# EAGLE design Dead Time (EAGLE 5.11)
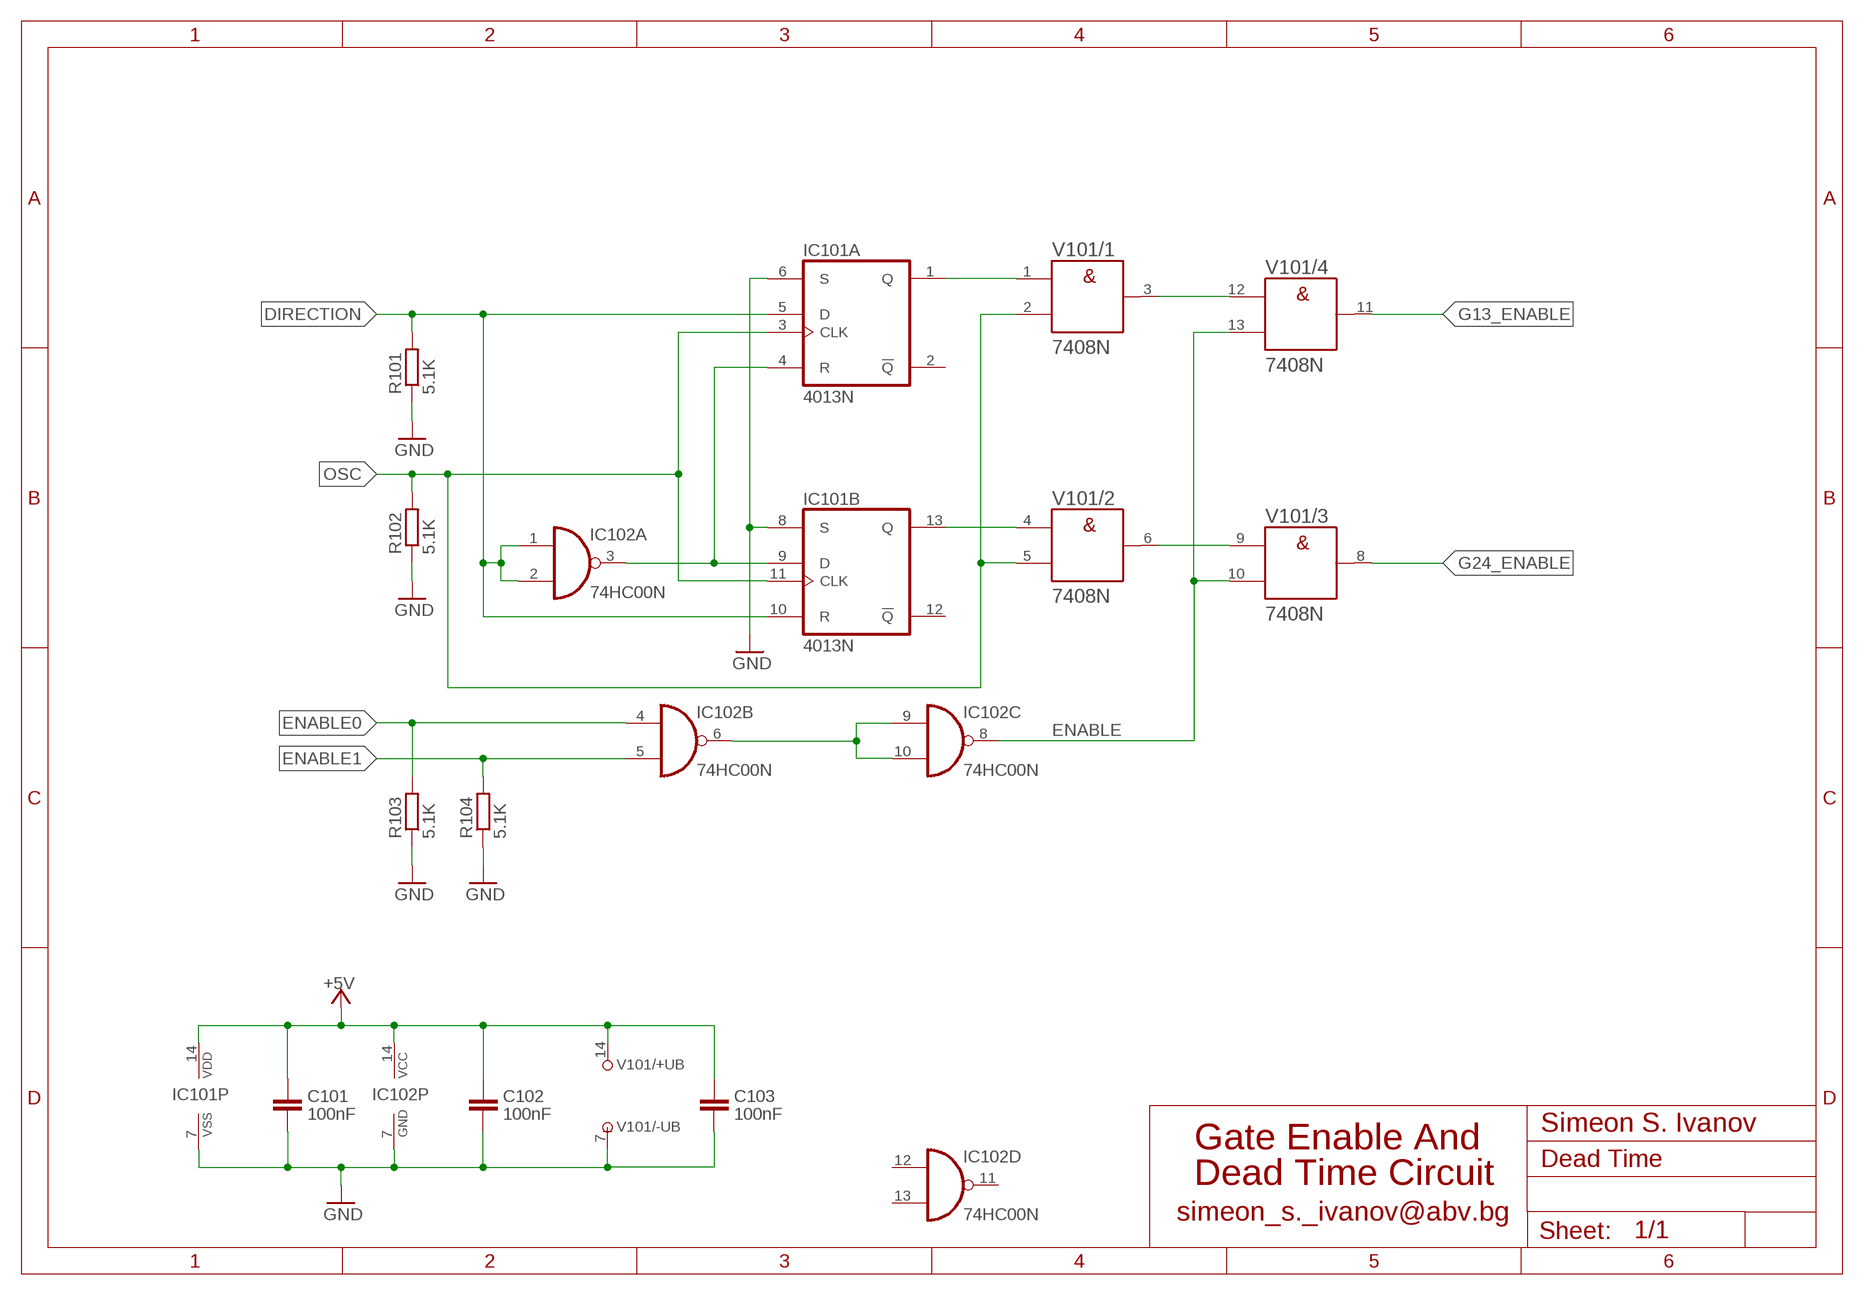
[diagram p0: schematic, sheet 1]

## Parts
C101  100nF  C-EUC0805  [C0805]
C102  100nF  C-EUC0805  [C0805]
C103  100nF  C-EUC0805  [C0805]
IC101  4013N  [DIL14]
IC102  74HC00N  [DIL14]
R101  5.1K  R-EU_0204/5  [0204/5]
R102  5.1K  R-EU_0204/5  [0204/5]
R103  5.1K  R-EU_0204/5  [0204/5]
R104  5.1K  R-EU_0204/5  [0204/5]
V101  7408N  [DIL14]

## Nets
!ENABLE: IC102.6(B:O) IC102.9(C:I0) IC102.10(C:I1)
+5V: C101.1 C102.1 C103.1 IC101.14(P:VDD) IC102.14(P:VCC) V101.14(/+UB:+UB)
DIRECTION: IC101.5(A:D) IC101.10(B:R) IC102.1(A:I0) IC102.2(A:I1) R101.2
ENABLE: IC102.8(C:O) V101.10(/3:B) V101.13(/4:B)
ENABLE0: IC102.4(B:I0) R103.2
ENABLE1: IC102.5(B:I1) R104.2
G13_ENABLE: V101.11(/4:Y)
G24_ENABLE: V101.8(/3:Y)
GND: C101.2 C102.2 C103.2 IC101.6(A:S) IC101.7(P:VSS) IC101.8(B:S) IC102.7(P:GND) R101.1 R102.1 R103.1 R104.1 V101.7(/-UB:-UB)
N$1: IC101.1(A:Q) V101.1(/1:A)
N$2: IC101.13(B:Q) V101.4(/2:A)
N$3: V101.3(/1:Y) V101.12(/4:A)
N$4: V101.6(/2:Y) V101.9(/3:A)
N$16: IC101.4(A:R) IC101.9(B:D) IC102.3(A:O)
OSC: IC101.3(A:CLK) IC101.11(B:CLK) R102.2 V101.2(/1:B) V101.5(/2:B)
Unconnected: IC101.2(A:!Q) IC101.12(B:!Q) IC102.11(D:O) IC102.12(D:I0) IC102.13(D:I1)

## Notes on the sheet
- Simeon S. Ivanov
- Gate Enable And
- Dead Time Circuit
- simeon_s._ivanov@abv.bg

## Library data of the parts
C101-C103 = rcl:C-EU: CAPACITOR, European symbol
IC101 = 40xx:4013: Dual D FLIP FLOP, set/reset
IC102 = 74xx-eu:74*00: Quad 2-input NAND gate
R101-R104 = rcl:R-EU_: RESISTOR, European symbol
V101 = 74ttl-din:74*08: Quad 2-input AND gate

## Board
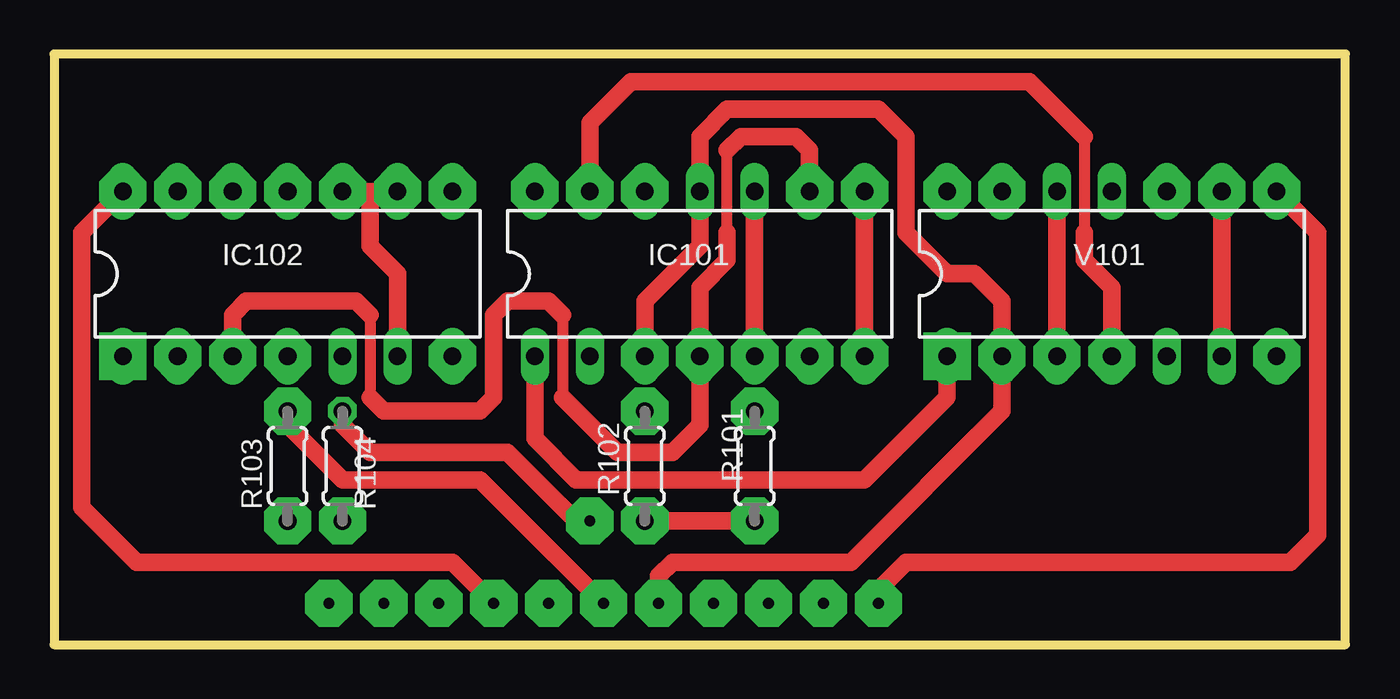
[diagram p1: board, top side]
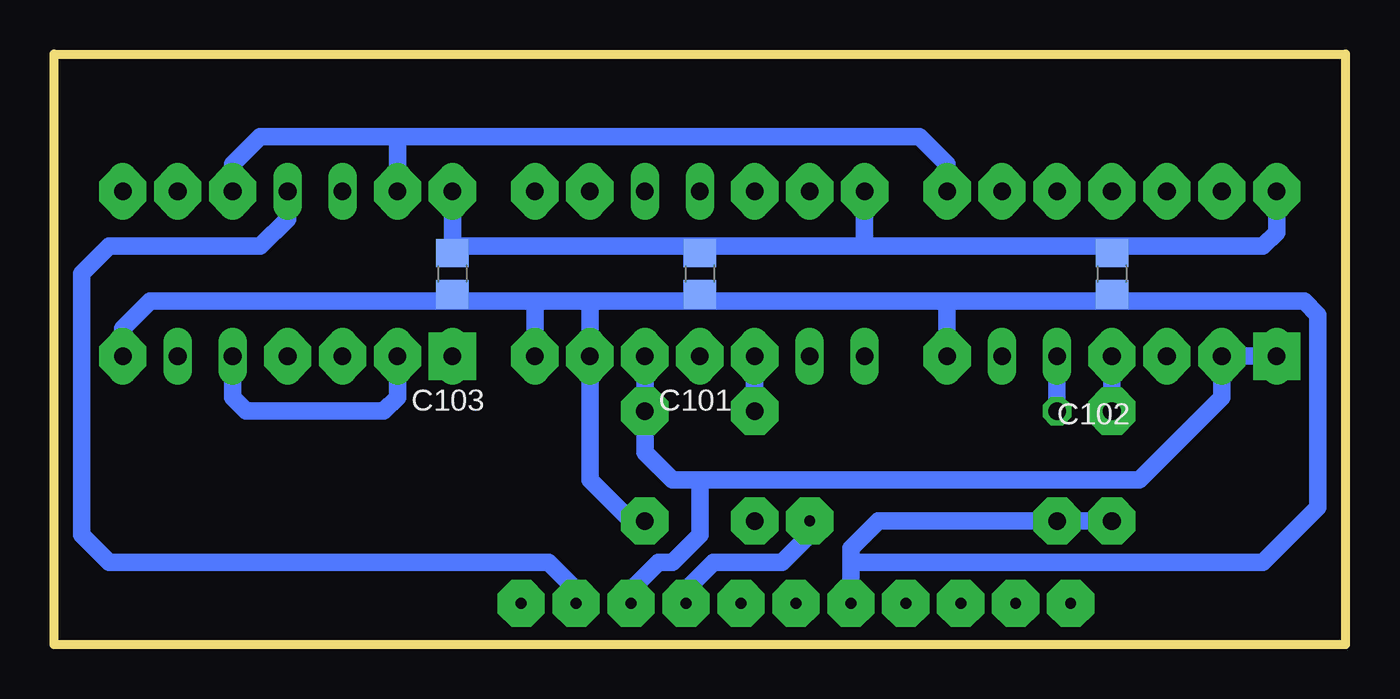
[diagram p2: board, bottom side, seen from below]

Size 59.69 x 27.3 mm. Coordinates in mm from the lower left corner, seen from the top.
Outline: 0,0 59.69,0 59.69,27.3 0,27.3 0,0
Copper layers (1*16): Top 0.035mm / dielectric 1.5mm / Bottom 0.035mm
Design rules "default": minimum track width 10mil, minimum drill 24mil, track to track 8mil, track to pad 8mil, pad to pad 8mil, via to via 8mil, smd to smd 8mil, copper to edge 40mil, drill to drill 8mil, minimum pad ring 10mil, minimum via ring 8mil, stop-mask expansion 4mil, vias tented up to drill 0mil, thermal gap 10mil

### Footprints (pad centres in the part's own frame; a part is rotated, then mirrored left to right if it is on the bottom)
C0805 = smd 1.3 x 1.5: 1 -0.95,0; 2 0.95,0
DIL14 = drill 0.813 long: 1 -7.62,-3.81; 2 -5.08,-3.81; 3 -2.54,-3.81; 4 0,-3.81; 5 2.54,-3.81; 6 5.08,-3.81; 7 7.62,-3.81; 8 7.62,3.81; 9 5.08,3.81; 10 2.54,3.81; 11 0,3.81; 12 -2.54,3.81; 13 -5.08,3.81; 14 -7.62,3.81
0204/5 = drill 0.813 octagon: 1 -2.54,0; 2 2.54,0

### Placement (x,y rotation side)
C101  29.84,17.14 270 bottom
C102  10.79,17.14 270 bottom
C103  41.27,17.14 270 bottom
IC101  29.84,17.14 0 top
IC102  10.79,17.14 0 top
R101  32.38,8.26 90 top
R102  27.3,8.26 90 top
R103  10.79,8.26 90 top
R104  13.34,8.26 90 top
V101  48.9,17.14 0 top

### Tracks (layer width: path | path; a pad name or v marks a point on that pad's centre or on a via)
!ENABLE  (via drill 0.5 pad 2.18)
  Top 0.813: IC102.6 15.88,17.14 14.61,18.41 14.61,20.95 | 14.61,20.95 IC102.10 | 14.61,20.95 IC102.9
  other vias: 13.34,20.95 15.88,20.95
+5V  (via drill 0.5 pad 2.18)
  Top 0.813: v20.32,1.91 18.41,3.81 3.81,3.81 1.27,6.35 1.27,19.05 IC102.14
  Bottom 0.813: IC102.14 3.17,19.05 3.81,18.41 10.79,18.41 | 10.79,18.41 22.23,18.41 | 22.23,18.41 29.84,18.41 | 29.84,18.41 41.27,18.41 | 22.23,18.41 v22.23,20.95 | 41.27,18.41 v41.27,20.95 | 29.84,18.41 C101.1 | 10.79,18.41 C102.1 | 41.27,18.41 C103.1
  other vias: 3.17,20.95
DIRECTION  (via drill 0.5 pad 1.27, 0.5 pad 2.18)
  Top 0.813: v32.38,13.34 IC101.10
  Bottom 0.813: v3.17,13.34 v5.71,13.34 5.71,11.43 9.53,7.62 29.84,7.62 | v32.38,13.34 v32.38,10.79 32.38,8.89 31.11,7.62 29.84,7.62 | v33.02,1.91 33.02,2.54 31.75,3.81 31.11,3.81 29.84,5.08 29.84,7.62
  other vias: 32.38,20.95
ENABLE  (via drill 0.5 pad 2.18)
  Bottom 0.813: 43.81,23.5 50.16,23.5 51.44,22.23 V101.10 | IC102.8 18.41,22.23 19.68,23.5 43.81,23.5 | 43.81,23.5 v43.81,20.95
  other vias: 51.44,20.95
ENABLE0  (via drill 0.5 pad 2.18)
  Top 0.813: v25.4,1.91 22.86,4.45 19.68,7.62 13.34,7.62 10.79,10.16 v10.79,10.79
  Bottom 0.813: v10.79,10.79 IC102.4
ENABLE1  (via drill 0.5 pad 1.27, 0.5 pad 2.18)
  Top 0.813: v13.34,10.79 13.34,10.16 14.61,8.89 20.95,8.89 24.13,5.71 v24.77,5.71
  Bottom 0.813: v13.34,10.79 IC102.5 | v30.48,1.91 30.48,2.54 29.21,3.81 26.67,3.81 26.04,3.81 24.77,5.08 v24.77,5.71
G13_ENABLE  (via drill 0.5 pad 1.27, 0.5 pad 2.18)
  Bottom 0.813: v35.56,1.91 35.56,2.54 36.83,3.81 57.15,3.81 58.42,5.08 58.42,17.14 57.15,18.41 50.16,18.41 48.9,19.68 V101.11
  other vias: 48.9,20.95
G24_ENABLE  (via drill 0.5 pad 2.18)
  Top 0.813: v38.1,1.91 38.1,2.54 39.37,3.81 57.15,3.81 58.42,5.08 58.42,19.05 V101.8
  other vias: 56.52,20.95
GND  (via drill 0.5 pad 2.18)
  Top 0.813: v37.47,13.34 v37.47,20.95 | v27.3,5.71 v32.38,5.71
  Bottom 0.813: 18.41,15.88 v18.41,13.34 | 10.79,15.88 1.91,15.88 1.27,15.24 1.27,6.35 3.81,3.81 22.86,3.81 | 10.79,15.88 18.41,15.88 | 18.41,15.88 29.84,15.88 | 29.84,15.88 34.92,15.88 | 34.92,15.88 37.47,15.88 | 37.47,15.88 41.27,15.88 | 41.27,15.88 55.24,15.88 56.52,14.61 v56.52,13.34 | 37.47,15.88 v37.47,13.34 | 34.92,15.88 v34.92,13.34 34.92,7.62 33.02,5.71 v32.38,5.71 | 29.84,15.88 C101.2 | 10.79,15.88 C102.2 | 22.86,3.81 v22.86,1.91 | 41.27,15.88 C103.2 | v10.79,5.71 v13.34,5.71 | v10.79,5.71 10.79,5.08 | v10.79,5.71 21.59,5.71 22.86,4.45 22.86,3.81
N$1  (via drill 0.5 pad 1.27, 0.5 pad 2.18)
  Top 0.813: v22.23,13.34 22.23,9.53 24.13,7.62 37.47,7.62 41.27,11.43 v41.27,13.34
N$2  (via drill 0.5 pad 2.18)
  Top 0.508: 47.62,23.5 47.62,19.05
  Top 0.813: IC101.13 24.77,24.13 26.67,26.04 45.09,26.04 47.62,23.5 | v48.9,13.34 48.9,16.51 47.62,17.78 47.62,19.05
  other vias: 24.77,20.95
N$3  (via drill 0.5 pad 1.27, 0.5 pad 2.18)
  Top 0.813: v46.35,13.34 v46.35,20.95
N$4  (via drill 0.5 pad 1.27, 0.5 pad 2.18)
  Top 0.813: v53.98,13.34 V101.9
  other vias: 53.98,20.95
N$5  (via drill 0.5 pad 2.18)
  other vias: 5.71,20.95
N$6  (via drill 0.5 pad 2.18)
  other vias: 8.26,20.95
N$7  (via drill 0.5 pad 2.18)
  other vias: 10.79,20.95
N$8  (via drill 0.5 pad 2.18)
  other vias: 17.78,1.91
N$9  (via drill 0.5 pad 2.18)
  other vias: 15.24,1.91
N$10  (via drill 0.5 pad 2.18)
  other vias: 18.41,20.95
N$11  (via drill 0.5 pad 1.27)
  other vias: 13.34,13.34
N$12  (via drill 0.5 pad 2.18)
  other vias: 10.79,13.34
N$13  (via drill 0.5 pad 1.27)
  other vias: 15.88,13.34
N$14  (via drill 0.5 pad 2.18)
  other vias: 27.3,20.95
N$15  (via drill 0.5 pad 1.27)
  other vias: 24.77,13.34
N$16  (via drill 0.5 pad 2.18)
  Top 0.508: 14.61,15.24 14.61,11.43 | 23.5,15.24 23.5,11.43 | 31.11,19.05 31.11,22.86
  Top 0.813: IC101.9 34.92,22.86 34.29,23.5 31.75,23.5 31.11,22.86 | v8.26,13.34 8.26,15.24 8.89,15.88 13.97,15.88 14.61,15.24 | 14.61,11.43 15.24,10.79 19.68,10.79 20.32,11.43 20.32,15.24 20.95,15.88 22.86,15.88 23.5,15.24 | 23.5,11.43 26.04,8.89 28.57,8.89 29.84,10.16 v29.84,13.34 29.84,16.51 31.11,17.78 31.11,19.05
  other vias: 34.92,20.95
N$17  (via drill 0.5 pad 2.18)
  other vias: 12.7,1.91
OSC  (via drill 0.5 pad 1.27, 0.5 pad 2.18)
  Top 0.813: v27.3,13.34 27.3,15.88 29.84,18.41 IC101.11 29.84,23.5 31.11,24.77 38.1,24.77 39.37,23.5 39.37,19.05 41.27,17.14 42.55,17.14 43.81,15.88 v43.81,13.34 43.81,10.79 36.83,3.81 28.57,3.81 27.94,3.17 v27.94,1.91
  Bottom 0.813: v27.3,13.34 v27.3,10.79 | v51.44,13.34 51.44,11.43 50.8,10.79 44.45,10.79 43.81,11.43 v43.81,13.34
  other vias: 29.84,20.95

### Text on the board
Document: Dead Time.lbr (19.06.15)
tDocu: 1 | 2 | 3 | 4 | 5 | 6 | 7 | 8 | 9 | 10 | 11 | NC | NC | NC | +5V | GND | ENABLE0 | OSC | ENABLE1 | DIRECTION | G13_ENABLE | G24_ENABLE